# Altium schematic sheet [00] - Power.SchDoc
size A4; Revision: 1.0; SheetNumber: 1
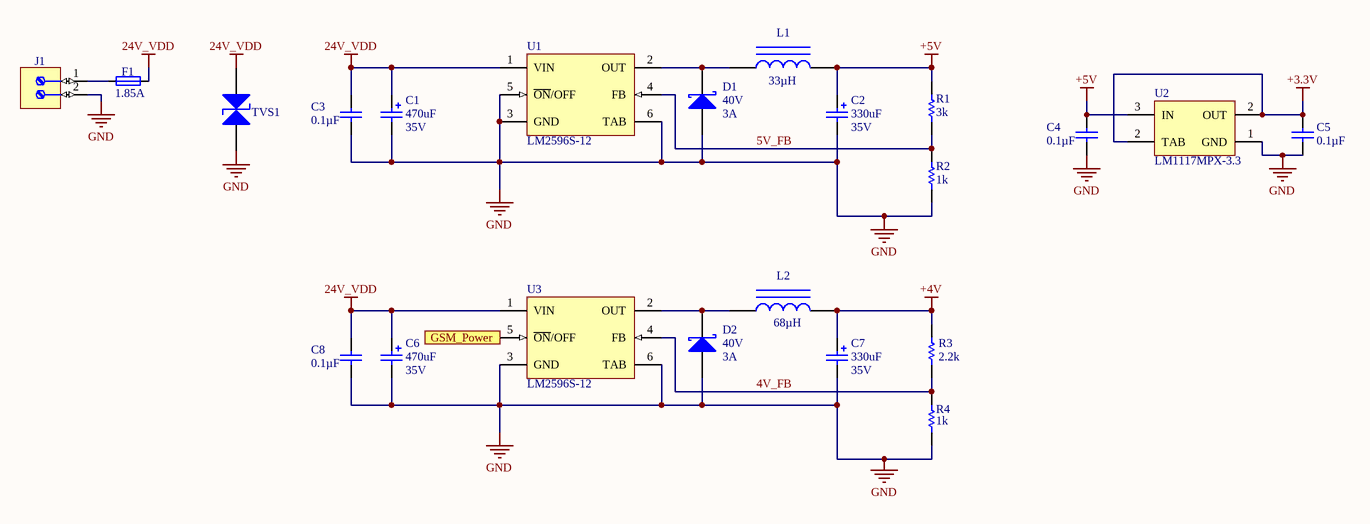
[diagram p0: [00] - Power.SchDoc]

## Parts
C1  Capacitance: 470uF  Voltage Rating: 35V  [Aluminium SMD G]  (hidden comment: Capacitor Polarized)
C2  Capacitance: 330uF  Voltage: 35V  [Aluminium SMD G]  (hidden comment: Capacitor Polarized)
C3  Capacitance: 0.1µF  [Cap 0603]  (hidden comment: Capacitor)
C4  Capacitance: 0.1µF  [Cap 0603]  (hidden comment: Capacitor)
C5  Capacitance: 0.1µF  [Cap 0603]  (hidden comment: Capacitor)
C6  Capacitance: 470uF  Voltage Rating: 35V  [Aluminium SMD G]  (hidden comment: Capacitor Polarized)
C7  Capacitance: 330uF  Voltage: 35V  [Aluminium SMD G]  (hidden comment: Capacitor Polarized)
C8  Capacitance: 0.1µF  [Cap 0603]  (hidden comment: Capacitor)
D1  Output Current: 3A  Voltage: 40V  [SMA]  (hidden comment: SK32)
D2  Output Current: 3A  Voltage: 40V  [SMA]  (hidden comment: SK32)
F1  Hold Current: 1.85A  [FUSR_LITTELFUSE_2920L]
J1  (no value)  [PHOENIX_1715721]
L1  Inductance: 33µH  [SRR1208]  (hidden comment: SRR1210)
L2  Inductance: 68µH  [SRR1208]  (hidden comment: SRR1210)
R1  Resistance: 3k  [Res-0603]  (hidden comment: Res1)
R2  Resistance: 1k  [Res-0603]  (hidden comment: Res1)
R3  Resistance: 2.2k  [Res-0603]  (hidden comment: Res1)
R4  Resistance: 1k  [Res-0603]  (hidden comment: Res1)
TVS1  TVS  [DO-201A]  (value not drawn)
U1  LM2596S-12  [TS5B_M]
U2  LM1117MPX-3.3  [SOT-223]
U3  LM2596S-12  [TS5B_M]

## Ports
GSM_Power (in)

## Nets
24V_VDD: C1.1 C3.2 C6.1 C8.2 F1.2 TVS1.1(A) U1.1(VIN) U3.1(VIN)
+3.3V: C5.2 U2.2(OUT)
+4V: C7.1 L2.2 R3.1
+5V: C2.1 C4.2 L1.2 R1.2 U2.3(IN)
GND: C1.2 C2.2 C3.1 C4.1 C5.1 C6.2 C7.2 C8.1 D1.1(A) D2.1(A) J1.2 R2.1 R4.1 TVS1.2(K) U1.3(GND) U1.5(~{ON}/OFF) U1.6(TAB) U2.1(GND) U3.3(GND) U3.6(TAB)
4V_FB: R3.2 R4.2 U3.4(FB)
5V_FB: R1.1 R2.2 U1.4(FB)
GSM_Power: U3.5(~{ON}/OFF) ; port GSM_Power
NetD1_2: D1.2(K) L1.1 U1.2(OUT)
NetD2_2: D2.2(K) L2.1 U3.2(OUT)
NetF1_1: F1.1 J1.1

## Notes on the sheet
- Title
- Size:
- Date:
- A4
- Number:
- Time:
- Revision:
- Sheet
- of
- File:

## Library data of the parts
C1 C6 = 4: Aluminium SMD Capacitors; Manufacturer: Nichicon; Manufacturer Part Number: UCL1V471MNL1GS; Tolerance: 20%; Ripple Current: 1.19A; Impedance: 60mR; Leakage Current: 3uA; Life (Hours): 2000Hour; Dissipation Factor: 0.12%; Supplier 1: Digi-Key; Supplier Part Number 1: 493-3961-6-ND; Stock 1: 25815; Pricing 1: 1=0.98, 10=0.747, 100=0.5345 (USD); Mount: Surface Mount; Case/Package: Radial; Number of Pins: 2; Material: Aluminium; Dielectric Material: Aluminium; Min Operating Temperature: -55°C; Max Operating Temperature: 105°C; Packaging: Tape and Reel; Package Quantity: 1; Voltage Rating (DC): 35V; Ripple Current (AC): 1.19A; Termination: SMD/SMT; Diameter: 10mm; Length: 13.5mm; Height: 13.5mm; Height - Seated (Max): 0.531inch; Radiation Hardening: No; REACH SVHC: No SVHC; Lead Free: Lead Free; ComponentLink1URL: https://datasheet.ciiva.com/30521/getdatasheetpartid-743876-30521937.pdf; ComponentLink1Description: https://datasheet.ciiva.com/30521/getdatasheetpartid-743876-30521937.pdf; ComponentLink2URL: https://datasheet.ciiva.com/98/e-cl-98467.pdf; ComponentLink2Description: https://datasheet.ciiva.com/98/e-cl-98467.pdf; ComponentLink3URL: https://datasheet.ciiva.com/98/e-cl-98468.pdf; ComponentLink3Description: https://datasheet.ciiva.com/98/e-cl-98468.pdf; ComponentLink4URL: https://datasheet.ciiva.com/98/e-cl-98469.pdf; ComponentLink4Description: https://datasheet.ciiva.com/98/e-cl-98469.pdf; ComponentLink5URL: https://datasheet.ciiva.com/22661/1910939-22661894.pdf; ComponentLink5Description: https://datasheet.ciiva.com/22661/1910939-22661894.pdf; ComponentLink6URL: https://datasheet.ciiva.com/28458/1910939-28458006.pdf; ComponentLink6Description: https://datasheet.ciiva.com/28458/1910939-28458006.pdf; ComponentLink7URL: https://datasheet.ciiva.com/6153/e-cl-6153975.pdf; ComponentLink7Description: https://datasheet.ciiva.com/6153/e-cl-6153975.pdf; ComponentLink8URL: https://datasheet.ciiva.com/11683/e-cl-11683743.pdf; ComponentLink8Description: https://datasheet.ciiva.com/11683/e-cl-11683743.pdf; ComponentLink9URL: https://datasheet.ciiva.com/16502/e-cl-16502287.pdf; ComponentLink9Description: https://datasheet.ciiva.com/16502/e-cl-16502287.pdf
C2 C7 = 4: Aluminium SMD Capacitors; Manufacturer: Panasonic; Manufacturer Part Number: EEE-1VA331P; Ripple Current (AC): 350mA; Tolerance: 20%; Polarity: Polar; Life (Hours): 2000Hour; Leakage Current: 3uA; Supplier 1: Digi-Key; Supplier Part Number 1: PCE3959DKR-ND; Stock 1: 40084; Pricing 1: 1=0.65, 10=0.482, 100=0.3304 (USD); Mount: Surface Mount,PCB; Case/Package: Radial; Contact Plating: Tin; Min Operating Temperature: -40°C; Max Operating Temperature: 85°C; Voltage Rating: 35V; Packaging: Tape and Reel; Ripple Current: 350mA; Voltage Rating (DC): 35V; Package Quantity: 500; Termination: SMD/SMT; Diameter: 10mm; Length: 10.5mm; Height: 10.2mm; Height - Seated (Max): 0.402inch; Radiation Hardening: No; REACH SVHC: No SVHC; Lead Free: Lead Free; ComponentLink1URL: https://datasheet.ciiva.com/16389/aba0000ce2-16389541.pdf; ComponentLink1Description: https://datasheet.ciiva.com/16389/aba0000ce2-16389541.pdf; ComponentLink2URL: https://datasheet.ciiva.com/30235/11aba0000ce2-30235093.pdf; ComponentLink2Description: https://datasheet.ciiva.com/30235/11aba0000ce2-30235093.pdf; ComponentLink3URL: https://datasheet.ciiva.com/46374/aba0000ce2-46374421.pdf; ComponentLink3Description: https://datasheet.ciiva.com/46374/aba0000ce2-46374421.pdf; ComponentLink4URL: https://datasheet.ciiva.com/43470/aba0000ce2-43470694.pdf; ComponentLink4Description: https://datasheet.ciiva.com/43470/aba0000ce2-43470694.pdf; ComponentLink5URL: https://datasheet.ciiva.com/14593/70255710-14593929.pdf; ComponentLink5Description: https://datasheet.ciiva.com/14593/70255710-14593929.pdf; ComponentLink6URL: https://datasheet.ciiva.com/24025/aba0000ce2-40801-24025561.pdf; ComponentLink6Description: https://datasheet.ciiva.com/24025/aba0000ce2-40801-24025561.pdf; ComponentLink7URL: https://datasheet.ciiva.com/14599/70255710-14599770.pdf; ComponentLink7Description: https://datasheet.ciiva.com/14599/70255710-14599770.pdf; ComponentLink8URL: https://datasheet.ciiva.com/17534/aba0000ce2-17534540.pdf; ComponentLink8Description: https://datasheet.ciiva.com/17534/aba0000ce2-17534540.pdf; ComponentLink9URL: https://datasheet.ciiva.com/31414/aba0000ce2-31414702.pdf; ComponentLink9Description: https://datasheet.ciiva.com/31414/aba0000ce2-31414702.pdf
C3-C5 C8 = 1: Chip Capacitor Nonpolar; Manufacturer: Kemet; Manufacturer Part Number: C0603C104K5RACTU; Tolerance: ±10%; Voltage - Rated: 50V; Temperature Coefficient: X7R; Supplier 1: Digi-Key; Supplier Part Number 1: 399-5089-1-ND; RoHS: RoHS Compliant; Category: Capacitors; Stock 1: 3992655; Pricing 1: 1=0.1, 10=0.041, 50=0.0222, 100=0.0187, 250=0.01532, 500=0.0131, 1000=0.0102 (USD); Packaging: Cut Tape (CT); Mounting Type: Surface Mount, MLCC; Operating Temperature: -55°C ~ 125°C; Applications: General Purpose; Ratings: -; Package / Case: 0603 (1608 Metric); Size / Dimension: 0.063" L x 0.031" W (1.60mm x 0.80mm); Height - Seated (Max): -; Thickness (Max): 0.034" (0.87mm); Lead Spacing: -; Features: -; Lead Style: -; ComponentLink1URL: http://www.kemet.com/docfinder?Partnumber=C0603C104K5RACTU; ComponentLink1Description: http://www.kemet.com/docfinder?Partnumber=C0603C104K5RACTU
D1 D2 = SK32: Schottky Rectifier; Manufacturer: Diodes; Manufacturer Part Number: B340A-13-F; Peak Reverse Current: 500uA; Forward Voltage: 500mV; Max Forward Surge Current (Ifsm): 80A; Element Configuration: Single; Polarity: Standard; Capacitance: 250pF; ComponentLink1Description: Manufacturer Link; ComponentLink1URL: http://www.irf.com/; ComponentLink2Description: Datasheet; ComponentLink2URL: http://www.irf.com/product-info/datasheets/data/18tq.pdf; Supplier 1: Digi-Key; Supplier Part Number 1: B340A-FDIDKR-ND; Stock 1: 761735; Pricing 1: 1=0.46, 10=0.373, 100=0.2538, 500=0.19034, 1000=0.14276 (USD); Mount: Surface Mount; Case/Package: SMA; Number of Pins: 2; Weight: 0.002258oz; Contact Plating: Tin,Matte; Min Operating Temperature: -55°C; Max Operating Temperature: 125°C; Forward Current: 3A; Packaging: Tape and Reel; Package Quantity: 5000; Average Rectified Current: 3A; Max Repetitive Reverse Voltage (Vrrm): 40V; Peak Non-Repetitive Surge Current: 80A; Termination: SMD/SMT; Voltage Rating (DC): 40V; Current Rating: 3A; Current: 3A; Max Reverse Voltage (DC): 40V; Length: 4.6mm; Height: 2.3mm; Width: 2.92mm; Radiation Hardening: No; REACH SVHC: No SVHC; Lead Free: Lead Free; ComponentLink3URL: https://datasheet.ciiva.com/4245/861ds30891-4245763.pdf; ComponentLink3Description: https://datasheet.ciiva.com/4245/861ds30891-4245763.pdf; ComponentLink4URL: https://datasheet.ciiva.com/26949/getdatasheetpartid-143394-26949352.pdf; ComponentLink4Description: https://datasheet.ciiva.com/26949/getdatasheetpartid-143394-26949352.pdf; ComponentLink5URL: https://datasheet.ciiva.com/1177/ds30891-1177476.pdf; ComponentLink5Description: https://datasheet.ciiva.com/1177/ds30891-1177476.pdf; ComponentLink6URL: https://datasheet.ciiva.com/1240/ds30891-1240228.pdf; ComponentLink6Description: https://datasheet.ciiva.com/1240/ds30891-1240228.pdf; ComponentLink7URL: https://datasheet.ciiva.com/913/ds30891-913637.pdf; ComponentLink7Description: https://datasheet.ciiva.com/913/ds30891-913637.pdf; ComponentLink8URL: https://datasheet.ciiva.com/913/ds30891-913638.pdf; ComponentLink8Description: https://datasheet.ciiva.com/913/ds30891-913638.pdf; ComponentLink9URL: https://datasheet.ciiva.com/913/ds30891-913639.pdf; ComponentLink9Description: https://datasheet.ciiva.com/913/ds30891-913639.pdf; ComponentLink10URL: https://datasheet.ciiva.com/46393/1911813-46393773.pdf; ComponentLink10Description: https://datasheet.ciiva.com/46393/1911813-46393773.pdf
F1 = FUSR_LITTELFUSE_2920L200/24: Fuse; Manufacturer: Bel; Manufacturer Part Number: 0ZCF0185FF2C; Description: PTC RESTTBLE 33V 1.85A CHIP 2920; Max Current Rating: 40A; Trip Current: 3.7A; Time to Trip: 2.5s; Author: CERN DEM JLC; Supplier 1: Digi-Key; Supplier Part Number 1: 507-1747-6-ND; Stock 1: 204388; Pricing 1: 1=0.28, 5=0.27, 10=0.257, 50=0.2296, 100=0.2138, 250=0.19008, 500=0.1584, 1000=0.15048 (USD); Case Code (Metric): 7351; Case Code (Imperial): 2920; Package Quantity: 1; Packaging: Tape and Reel; Lead Free: Lead Free
J1 = PHOENIX_1715721: Terminal Block, 2 Positions, Screw Connection; Part Description: 17.5A, 400V, Terminal Block, Pitch 5.08mm, 2 Positions, Screw Connection; Manufacturer: PHOENIX CONTACT; Manufacturer Part Number: 1715721 (MKDS 1,5/2-5,08); PressFit: No; Part Number: PHOENIX_1715721; Component Kind: Standard; Component Type: Standard; Pin Count: 2; Mounted: Yes; Socket: No; SMD: No; Sense: No; Status: None; ComponentHeight: 13.8mm; HelpURL: \\cern.ch\dfs\Applications\Altium\Datasheets\PHOENIX_1715721.pdf; Author: CERN DEM JLC; CreateDate: 06.01.2010; LatestRevisionDate: 25.02.2013
L1 = SRR1210: Magnetic-Core Inductor; Manufacturer: Bourns Inc.; Manufacturer Part Number: SRR1208-330YL; Type: Wirewound; Material - Core: Ferrite; Tolerance: ±15%; Current Rating: 2.8A; Current - Saturation: 3.8A; Shielding: Shielded; DC Resistance (DCR): 62 mOhm Max; Q @ Freq: 23 @ 2.52MHz; Frequency - Self Resonant: 6.5MHz; Frequency - Test: 1kHz; Value: 33µH; Supplier 1: Digi-Key; Supplier Part Number 1: SRR1208-330YLCT-ND; RoHS: RoHS Compliant; Category: Inductors, Coils, Chokes; Stock 1: 5101; Pricing 1: 1=0.9, 10=0.84, 25=0.784, 50=0.672, 100=0.6384 (USD); Packaging: Cut Tape (CT); Operating Temperature: -40°C ~ 125°C; Mounting Type: Surface Mount; Package / Case: Non Standard; Size / Dimension: 0.500" L x 0.500" W (12.70mm x 12.70mm); Height - Seated (Max): 0.335" (8.50mm); Supplier Device Package: -; ComponentLink1URL: http://www.bourns.com/data/global/pdfs/SRR1208.pdf; ComponentLink1Description: http://www.bourns.com/data/global/pdfs/SRR1208.pdf
L2 = SRR1210: Magnetic-Core Inductor; Manufacturer: Bourns Inc.; Manufacturer Part Number: SRR1210-680M; Type: Wirewound; Material - Core: Ferrite; Tolerance: ±20%; Current Rating: 3A; Current - Saturation: 2.7A; Shielding: Shielded; DC Resistance (DCR): 102 mOhm Max; Q @ Freq: 12 @ 2.52MHz; Frequency - Self Resonant: 3.8MHz; Frequency - Test: 100kHz; Value: 68µH; Published: 24-Mar-1999; LatestRevisionDate: 17-Jul-2002; LatestRevisionNote: Re-released for DXP Platform.; PackageReference: AXIAL-0.9; Publisher: Altium Limited; PackageDescription: Axial Device, Thru-Hole; 2 Leads; 0.9 in Pin Spacing; Supplier 1: Digi-Key; Supplier Part Number 1: SRR1210-680MCT-ND; RoHS: RoHS Compliant; Category: Inductors, Coils, Chokes; Stock 1: 2411; Pricing 1: 1=1.06, 10=0.99, 25=0.924, 50=0.792, 100=0.7524 (USD); Packaging: Cut Tape (CT); Operating Temperature: -40°C ~ 125°C; Mounting Type: Surface Mount; Package / Case: Non Standard; Size / Dimension: 0.472" L x 0.472" W (12.00mm x 12.00mm); Height - Seated (Max): 0.394" (10.00mm); Supplier Device Package: -; ComponentLink1URL: http://www.bourns.com/data/global/pdfs/SRR1210.pdf; ComponentLink1Description: http://www.bourns.com/data/global/pdfs/SRR1210.pdf
R1 = 1: Chip Resistor; Manufacturer: Panasonic; Manufacturer Part Number: ERJ-3GEYJ302V; Tolerance: 5%; Power Rating: 100mW; Voltage Rating: 75V; Temperature Coefficient: 200ppm/°C; Supplier 1: Digi-Key; Supplier Part Number 1: P3.0KGDKR-ND; Stock 1: 423309; Pricing 1: 1=0.1, 10=0.054, 100=0.022, 1000=0.00988, 2500=0.00858 (USD); Mount: Surface Mount; Case/Package: 0603; Case Code (Metric): 1608; Case Code (Imperial): 0603; Contact Plating: Tin; Min Operating Temperature: -55°C; Max Operating Temperature: 155°C; Packaging: Tape and Reel; Package Quantity: 1; Composition: Thick Film; Number of Terminations: 2; Termination: SMD/SMT; Military Standard: Not; Max Power Dissipation: 100mW; Features: Automotive AEC-Q200; Length: 1.6mm; Height: 0.45mm; Width: 0.031inch; Depth: 0.8mm; REACH SVHC: No SVHC; ComponentLink1URL: https://datasheet.ciiva.com/11821/0900766b80f806dd-11821475.pdf; ComponentLink1Description: https://datasheet.ciiva.com/11821/0900766b80f806dd-11821475.pdf; ComponentLink2URL: https://datasheet.ciiva.com/43460/1500035-43460725.pdf; ComponentLink2Description: https://datasheet.ciiva.com/43460/1500035-43460725.pdf; ComponentLink3URL: https://datasheet.ciiva.com/24027/aoa0000ce1-37422-24027397.pdf; ComponentLink3Description: https://datasheet.ciiva.com/24027/aoa0000ce1-37422-24027397.pdf; ComponentLink4URL: https://datasheet.ciiva.com/9196/aoa0000ce1-9196743.pdf; ComponentLink4Description: https://datasheet.ciiva.com/9196/aoa0000ce1-9196743.pdf; ComponentLink5URL: https://datasheet.ciiva.com/16786/70255313-16786823.pdf; ComponentLink5Description: https://datasheet.ciiva.com/16786/70255313-16786823.pdf; ComponentLink6URL: https://datasheet.ciiva.com/9196/aoa0000ce1-9196746.pdf; ComponentLink6Description: https://datasheet.ciiva.com/9196/aoa0000ce1-9196746.pdf; ComponentLink7URL: https://datasheet.ciiva.com/46386/1500035-46386731.pdf; ComponentLink7Description: https://datasheet.ciiva.com/46386/1500035-46386731.pdf; ComponentLink8URL: https://datasheet.ciiva.com/30196/4aoa0000ce1-30196300.pdf; ComponentLink8Description: https://datasheet.ciiva.com/30196/4aoa0000ce1-30196300.pdf; ComponentLink9URL: https://datasheet.ciiva.com/28565/1678796-28565150.pdf; ComponentLink9Description: https://datasheet.ciiva.com/28565/1678796-28565150.pdf; ComponentLink10URL: https://datasheet.ciiva.com/28691/1678796-28691966.pdf; ComponentLink10Description: https://datasheet.ciiva.com/28691/1678796-28691966.pdf
R2 R4 = 1: Chip Resistor; Manufacturer: Panasonic; Manufacturer Part Number: ERJ-3GEYJ102V; Power Rating: 100mW; Tolerance: 5%; Voltage Rating: 75V; Temperature Coefficient: 200ppm/°C; Voltage Rating (DC): 50V; Supplier 1: Digi-Key; Supplier Part Number 1: P1.0KGDKR-ND; Stock 1: 2655329; Pricing 1: 1=0.1, 10=0.054, 100=0.022, 1000=0.00988, 2500=0.00858 (USD); Mount: Surface Mount; Case/Package: 0603; Weight: 7.1E-05oz; Case Code (Metric): 1608; Case Code (Imperial): 0603; Contact Plating: Tin; Min Operating Temperature: -55°C; Max Operating Temperature: 155°C; Packaging: Tape and Reel; Package Quantity: 1; Composition: Thick Film; Number of Terminations: 2; Termination: SMD/SMT; Military Standard: Not; Max Power Dissipation: 100mW; Working Voltage: 75V; Features: Automotive AEC-Q200; Length: 1.6mm; Height: 0.45mm; Width: 0.031inch; Depth: 0.8mm; Radiation Hardening: No; REACH SVHC: No SVHC; Lead Free: Lead Free; ComponentLink1URL: https://datasheet.ciiva.com/11808/0900766b80f806dd-11808320.pdf; ComponentLink1Description: https://datasheet.ciiva.com/11808/0900766b80f806dd-11808320.pdf; ComponentLink2URL: https://datasheet.ciiva.com/34303/1988487-34303608.pdf; ComponentLink2Description: https://datasheet.ciiva.com/34303/1988487-34303608.pdf; ComponentLink3URL: https://datasheet.ciiva.com/16740/aoa0000ce1-16740759.pdf; ComponentLink3Description: https://datasheet.ciiva.com/16740/aoa0000ce1-16740759.pdf; ComponentLink4URL: https://datasheet.ciiva.com/30224/4aoa0000ce1-30224167.pdf; ComponentLink4Description: https://datasheet.ciiva.com/30224/4aoa0000ce1-30224167.pdf; ComponentLink5URL: https://datasheet.ciiva.com/24159/aoa0000ce1-37422-24159481.pdf; ComponentLink5Description: https://datasheet.ciiva.com/24159/aoa0000ce1-37422-24159481.pdf; ComponentLink6URL: https://datasheet.ciiva.com/16787/70255313-16787626.pdf; ComponentLink6Description: https://datasheet.ciiva.com/16787/70255313-16787626.pdf; ComponentLink7URL: https://datasheet.ciiva.com/43460/1678796-43460714.pdf; ComponentLink7Description: https://datasheet.ciiva.com/43460/1678796-43460714.pdf; ComponentLink8URL: https://datasheet.ciiva.com/46451/1678796-46451226.pdf; ComponentLink8Description: https://datasheet.ciiva.com/46451/1678796-46451226.pdf; ComponentLink9URL: https://datasheet.ciiva.com/9117/aoa0000ce1-9117035.pdf; ComponentLink9Description: https://datasheet.ciiva.com/9117/aoa0000ce1-9117035.pdf; ComponentLink10URL: https://datasheet.ciiva.com/46386/1678796-46386459.pdf; ComponentLink10Description: https://datasheet.ciiva.com/46386/1678796-46386459.pdf; ComponentLink11URL: https://datasheet.ciiva.com/48532/aoa0000ce1-48532155.pdf; ComponentLink11Description: https://datasheet.ciiva.com/48532/aoa0000ce1-48532155.pdf; ComponentLink12URL: https://datasheet.ciiva.com/22783/1678796-22783822.pdf; ComponentLink12Description: https://datasheet.ciiva.com/22783/1678796-22783822.pdf; ComponentLink13URL: https://datasheet.ciiva.com/28532/1678796-28532126.pdf; ComponentLink13Description: https://datasheet.ciiva.com/28532/1678796-28532126.pdf; ComponentLink14URL: https://datasheet.ciiva.com/46371/1678796-46371934.pdf; ComponentLink14Description: https://datasheet.ciiva.com/46371/1678796-46371934.pdf
R3 = 1: Chip Resistor; Manufacturer: Panasonic; Manufacturer Part Number: ERJ-3GEYJ222V; Power Rating: 100mW; Tolerance: 5%; Voltage Rating: 75V; Temperature Coefficient: 200ppm/°C; Voltage Rating (DC): 50V; ComponentLink1URL: https://datasheet.ciiva.com/11821/0900766b80f806dd-11821453.pdf; ComponentLink1Description: https://datasheet.ciiva.com/11821/0900766b80f806dd-11821453.pdf; ComponentLink2URL: https://datasheet.ciiva.com/34303/1988639-34303614.pdf; ComponentLink2Description: https://datasheet.ciiva.com/34303/1988639-34303614.pdf; ComponentLink3URL: https://datasheet.ciiva.com/16760/70255313-16760341.pdf; ComponentLink3Description: https://datasheet.ciiva.com/16760/70255313-16760341.pdf; ComponentLink4URL: https://datasheet.ciiva.com/9117/aoa0000ce1-9117127.pdf; ComponentLink4Description: https://datasheet.ciiva.com/9117/aoa0000ce1-9117127.pdf; ComponentLink5URL: https://datasheet.ciiva.com/46380/1500035-46380411.pdf; ComponentLink5Description: https://datasheet.ciiva.com/46380/1500035-46380411.pdf; ComponentLink6URL: https://datasheet.ciiva.com/16765/70255313-16765244.pdf; ComponentLink6Description: https://datasheet.ciiva.com/16765/70255313-16765244.pdf; ComponentLink7URL: https://datasheet.ciiva.com/16199/aoa0000ce1-16199902.pdf; ComponentLink7Description: https://datasheet.ciiva.com/16199/aoa0000ce1-16199902.pdf; ComponentLink8URL: https://datasheet.ciiva.com/16853/aoa0000ce1-16853407.pdf; ComponentLink8Description: https://datasheet.ciiva.com/16853/aoa0000ce1-16853407.pdf; ComponentLink9URL: https://datasheet.ciiva.com/22758/1500035-22758223.pdf; ComponentLink9Description: https://datasheet.ciiva.com/22758/1500035-22758223.pdf; ComponentLink10URL: https://datasheet.ciiva.com/28584/1678796-28584095.pdf; ComponentLink10Description: https://datasheet.ciiva.com/28584/1678796-28584095.pdf; Supplier 1: Digi-Key; Supplier Part Number 1: P2.2KGDKR-ND; Stock 1: 1578287; Pricing 1: 1=0.1, 10=0.054, 100=0.022, 1000=0.00988, 2500=0.00858 (USD); Mount: Surface Mount; Case/Package: 0603; Case Code (Imperial): 0603; Case Code (Metric): 1608; Contact Plating: Tin; Min Operating Temperature: -55°C; Max Operating Temperature: 155°C; Package Quantity: 1; Packaging: Tape and Reel; Composition: Thick Film; Number of Terminations: 2; Military Standard: Not; Termination: SMD/SMT; Max Power Dissipation: 100mW; Features: Automotive AEC-Q200; Working Voltage: 75V; Length: 1.6mm; Height: 0.45mm; Width: 0.8mm; Depth: 0.8mm; Radiation Hardening: No; REACH SVHC: No SVHC; Lead Free: Lead Free
TVS1 = 8: Manufacturer: STMicroelectronics; Manufacturer Part Number: 1.5KE36A; Description: TVS DIODE 30.8VWM 64.3VC DO201; Direction: Unidirectional; Reverse Breakdown Voltage: 34.2V; Max Surge Current: 1mA; Capacitance: 2.5nF; Operating Supply Voltage: 30.8V; Number of Elements: 1; Clamping Voltage: 64.3V; Peak Pulse Power: 1.5kW; Power Line Protection: No; Max Breakdown Voltage: 37.8V; Max Reverse Leakage Current: 1uA; Peak Pulse Current: 156A; Element Configuration: Single; Voltage Rating (DC): 36V; Parameter 1: *; Supplier 1: Digi-Key; Supplier Part Number 1: 497-11379-1-ND; Stock 1: 3643; Pricing 1: 1=0.68, 10=0.601, 100=0.4605 (USD); Mount: Through Hole; Number of Pins: 2; Min Operating Temperature: -65°C; Max Operating Temperature: 175°C; Package Quantity: 1; Packaging: Tape and Reel; Number of Unidirectional Channels: 1; Reverse Standoff Voltage: 30.8V; Min Breakdown Voltage: 34.2V; Breakdown Voltage: 34.2V; Polarity: Unidirectional; Termination: Through Hole; Test Current: 1mA; Power Dissipation: 1.5kW; Leakage Current: 1uA; Composition: Zener; Diameter: 5.3mm; Length: 9.5mm; Height: 5.3mm; Width: 5.3mm; Radiation Hardening: No; REACH SVHC: No SVHC; Lead Free: Lead Free
U1 U3 = LM2596S-12: SIMPLE SWITCHER® Power Converter 150 KHz 3A Step-Down Voltage Regulator, 5-pin TO-263; Manufacturer: TI National Semiconductor; Manufacturer Part Number: LM2596S-12/NOPB; Output Voltage: 12V; Number of Outputs: 1; Efficiency: 90%; Min Input Voltage: 4.5V; Max Input Voltage: 40V; Switching Frequency: 173kHz; Quiescent Current: 5mA; Output Type: Fixed; ComponentLink1Description: LM2596 Datasheet; ComponentLink1URL: http://www.national.com/ds/LM/LM2596.pdf; ComponentLink2Description: LM2596 Web Page; ComponentLink2URL: http://www.national.com/pf/LM/LM2596.html; ComponentLink3Description: TS5B Package Page; ComponentLink3URL: http://www.national.com/packaging/folders/ts5b.html; ComponentLink4URL: http://www.onsemi.com/pub_link/Collateral/LM2596-D.PDF; ComponentLink4Description: http://www.onsemi.com/pub_link/Collateral/LM2596-D.PDF; Supplier 1: Digi-Key; Supplier Part Number 1: LM2596S-12/NOPB-ND; Stock 1: 4101; Pricing 1: 1=5.72, 10=5.141, 100=4.212, 500=3.5856, 1000=3.024 (USD); Mount: Surface Mount; Case/Package: TO-263; Number of Pins: 5; Weight: 0.056128oz; Min Operating Temperature: -40°C; Max Operating Temperature: 125°C; Output Current: 3A; Packaging: Rail/Tube; Max Output Current: 3A; Nominal Output Voltage: 12V; Operating Supply Voltage: 40V; Length: 10.16mm; Height: 4.57mm; Width: 8.64mm; Radiation Hardening: No; Lead Free: Contains Lead; REACH SVHC: No SVHC; ComponentLink5URL: https://datasheet.ciiva.com/27055/1992806-27055836.pdf; ComponentLink5Description: https://datasheet.ciiva.com/27055/1992806-27055836.pdf; ComponentLink6URL: https://datasheet.ciiva.com/15113/getdatasheetpartid-188198-15113341.pdf; ComponentLink6Description: https://datasheet.ciiva.com/15113/getdatasheetpartid-188198-15113341.pdf; ComponentLink7URL: https://datasheet.ciiva.com/26103/lm2596-26103191.pdf; ComponentLink7Description: https://datasheet.ciiva.com/26103/lm2596-26103191.pdf; ComponentLink8URL: https://datasheet.ciiva.com/7994/1874590-7994252.pdf; ComponentLink8Description: https://datasheet.ciiva.com/7994/1874590-7994252.pdf; ComponentLink9URL: https://datasheet.ciiva.com/3219/lm2596-3219983.pdf; ComponentLink9Description: https://datasheet.ciiva.com/3219/lm2596-3219983.pdf; ComponentLink10URL: https://datasheet.ciiva.com/6580/lm2596-6580207.pdf; ComponentLink10Description: https://datasheet.ciiva.com/6580/lm2596-6580207.pdf
U2 = LM1117MPX-3.3: 800mA Low-Dropout Linear Regulator, 4-pin SOT-223; Manufacturer: Texas Instruments; Manufacturer Part Number: LM1117MPX-3.3/NOPB; Min Input Voltage: 2.6V; Max Input Voltage: 15V; Nominal Output Voltage: 3.3V; Dropout Voltage: 1.2V; Number of Outputs: 1; Polarity: Positive; Quiescent Current: 10mA; Accuracy: 1%; ComponentLink1Description: LM1117 Datasheet; ComponentLink1URL: http://www.national.com/ds/LM/LM1117.pdf; ComponentLink2Description: LM1117 Web Page; ComponentLink2URL: http://www.national.com/pf/LM/LM1117.html; ComponentLink3Description: MP04A Package Page; ComponentLink3URL: http://www.national.com/packaging/folders/mp04a.html; Supplier 1: Digi-Key; Supplier Part Number 1: LM1117MPX-3.3/NOPBDKR-ND; Stock 1: 120330; Pricing 1: 1=1.14, 10=1.015, 100=0.7912, 500=0.65364, 1000=0.51603 (USD); Mount: Surface Mount; Case/Package: SOT-223; Number of Pins: 4; Contact Plating: Tin,Matte; Min Operating Temperature: -40°C; Max Operating Temperature: 125°C; Output Current: 800mA; Packaging: Tape and Reel; Output Voltage: 3.3V; Max Output Current: 800mA; Current Rating: 800mA; Output Voltage Accuracy: 1%; Max Output Voltage: 3.3V; Length: 6.5mm; Height: 1.6mm; Width: 3.56mm; REACH SVHC: No SVHC; Lead Free: Lead Free; ComponentLink4URL: https://datasheet.ciiva.com/49027/1882372-49027926.pdf; ComponentLink4Description: https://datasheet.ciiva.com/49027/1882372-49027926.pdf; ComponentLink5URL: https://datasheet.ciiva.com/46370/1772317-46370251.pdf; ComponentLink5Description: https://datasheet.ciiva.com/46370/1772317-46370251.pdf